# Altium schematic sheet FPGA_Memec_Virtex2_V2MB1000_Rev3_Dev_Kit.SchDoc: Example for Memec V2MB1000 Rev3 Board
size B; Address1: L3, 12a Rodborough Rd; Address2: Frenchs Forest; Address3: NSW; Address4: Australia 2086; DocumentNumber: 1; Organization: Altium Limited; SheetNumber: 1; SheetTotal: 3
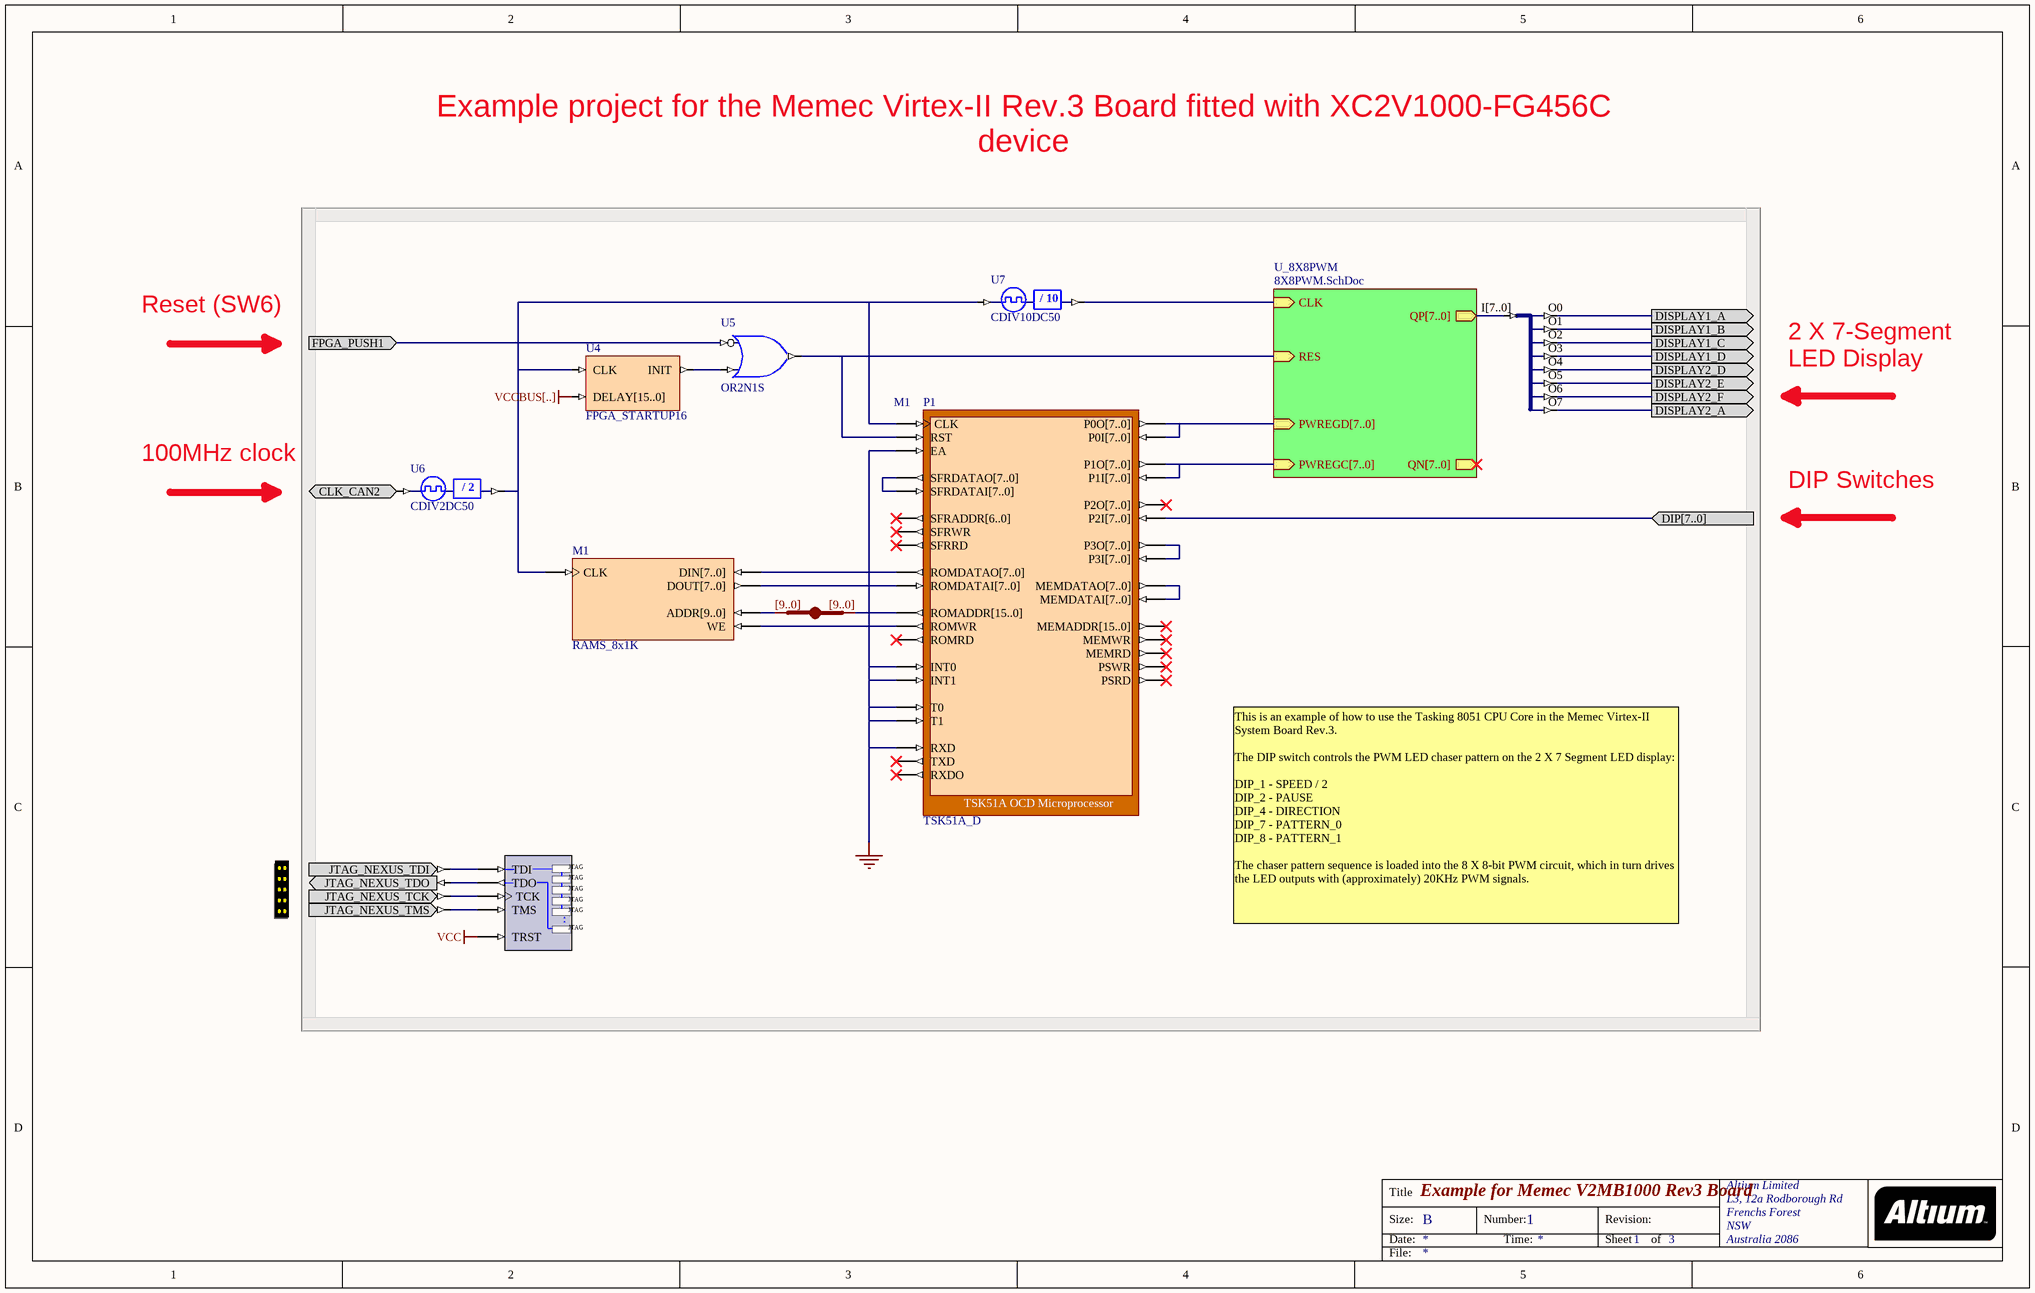
[diagram p0: FPGA_Memec_Virtex2_V2MB1000_Rev3_Dev_Kit.SchDoc]

## Parts
?  NEXUS_JTAG_CONNECTOR  (value not drawn)
JB_1  IndexA: [9..0]  (hidden comment: JB)
M1  RAMS_8x1K
NEXUS_JTAG_PORT  NEXUS_JTAG_PORT  (value not drawn)
P1  TSK51A_D  ChildCore1: M1
U4  FPGA_STARTUP16
U5  OR2N1S
U6  CDIV2DC50
U7  CDIV10DC50
U9  J8B_8S  (value not drawn)

## Sub-sheets
U_8X8PWM = 8X8PWM.SchDoc: PWREGD[7..0] (in), PWREGC[7..0] (in), CLK (in), RES (in), QP[7..0] (out), QN[7..0] (out)

## Ports
CLK_CAN2 (in), DIP[7..0] (in), DISPLAY1_A (out), DISPLAY1_B (out), DISPLAY1_C (out), DISPLAY1_D (out), DISPLAY2_A (out), DISPLAY2_D (out), DISPLAY2_E (out), DISPLAY2_F (out), FPGA_PUSH1 (in)

## Nets
GND: P1.EA P1.INT0 P1.INT1 P1.RXD P1.T0 P1.T1
VCC: NEXUS_JTAG_PORT.TRST
VCCBUS[..]: U4.DELAY[15..0]
CLK_CAN2: U6.CLKIN ; port CLK_CAN2
DIP[7..0]: P1.P2I[7..0] ; port DIP[7..0]
DISPLAY1_A: U9.O0 ; port DISPLAY1_A
DISPLAY1_B: U9.O1 ; port DISPLAY1_B
DISPLAY1_C: U9.O2 ; port DISPLAY1_C
DISPLAY1_D: U9.O3 ; port DISPLAY1_D
DISPLAY2_A: U9.O7 ; port DISPLAY2_A
DISPLAY2_D: U9.O4 ; port DISPLAY2_D
DISPLAY2_E: U9.O5 ; port DISPLAY2_E
DISPLAY2_F: U9.O6 ; port DISPLAY2_F
FPGA_PUSH1: U5.I0 ; port FPGA_PUSH1
Net?_JTAG_NEXUS_TCK: ?.JTAG_NEXUS_TCK NEXUS_JTAG_PORT.TCK
Net?_JTAG_NEXUS_TDI: ?.JTAG_NEXUS_TDI NEXUS_JTAG_PORT.TDI
Net?_JTAG_NEXUS_TDO: ?.JTAG_NEXUS_TDO NEXUS_JTAG_PORT.TDO
Net?_JTAG_NEXUS_TMS: ?.JTAG_NEXUS_TMS NEXUS_JTAG_PORT.TMS
NetJB_1_A[0..0]: JB_1.A[0..0] M1.ADDR[9..0]
NetJB_1_B[0..0]: JB_1.B[0..0] P1.ROMADDR[15..0]
NetM1_CLK: M1.CLK P1.CLK U4.CLK U6.CLKDV U7.CLKIN
NetM1_DIN[7..0]: M1.DIN[7..0] P1.ROMDATAO[7..0]
NetM1_DOUT[7..0]: M1.DOUT[7..0] P1.ROMDATAI[7..0]
NetM1_WE: M1.WE P1.ROMWR
NetP1_MEMDATAI[7..0]: P1.MEMDATAI[7..0] P1.MEMDATAO[7..0]
NetP1_P0I[7..0]: P1.P0I[7..0] P1.P0O[7..0] ; sheet U_8X8PWM/PWREGD[7..0]
NetP1_P1I[7..0]: P1.P1I[7..0] P1.P1O[7..0] ; sheet U_8X8PWM/PWREGC[7..0]
NetP1_P3I[7..0]: P1.P3I[7..0] P1.P3O[7..0]
NetP1_RST: P1.RST U5.O ; sheet U_8X8PWM/RES
NetP1_SFRDATAI[7..0]: P1.SFRDATAI[7..0] P1.SFRDATAO[7..0]
NetU4_INIT: U4.INIT U5.I1
NetU7_CLKDV: U7.CLKDV ; sheet U_8X8PWM/CLK
NetU9_I[7..0]: U9.I[7..0] ; sheet U_8X8PWM/QP[7..0]

Not connected (* = marked no-connect by the designer): P1 MEMADDR[15..0]* MEMRD* MEMWR* P2O[7..0]* PSRD* PSWR* ROMRD* RXDO* SFRADDR[6..0]* SFRRD* SFRWR* TXD*

## Notes on the sheet
- Example project for the Memec Virtex-II Rev.3 Board fitted with XC2V1000-FG456C device
- Reset (SW6)
- 2 X 7-Segment LED Display
- 100MHz clock
- DIP Switches
- This is an example of how to use the Tasking 8051 CPU Core in the Memec Virtex-II System Board Rev.3.
  The DIP switch controls the PWM LED chaser pattern on the 2 X 7 Segment LED display:
  DIP_1 - SPEED / 2
  DIP_2 - PAUSE
  DIP_4 - DIRECTION
  DIP_7 - PATTERN_0
  DIP_8 - PATTERN_1
  The chaser pattern sequence is loaded into the 8 X 8-bit PWM circuit, which in turn drives the LED outputs with (approximately) 20KHz PWM signals.
- Title
- Size:
- Date:
- B
- Number:
- Time:
- Revision:
- Sheet
- of
- File:
- (in symbol CDIV2DC50) / 2
- (in symbol CDIV10DC50) / 10
- (in symbol NEXUS_JTAG_PORT) JTAG; .

## Library data of the parts
? = NEXUS_JTAG_CONNECTOR: JTAG Port; PortComponent: True; Published: 19-Nov-2003; Publisher: Altium Limited
JB_1 = JB: System BUS Joiner; Published: 29-Jan-2004; Publisher: Altium Limited; IndexB: [9..0]; LastRevisionNo: 1.00.00; HelpURL: CR0118 FPGA Generic Library Guide.pdf#page=296; FunctionalClass: Bus Joiner
M1 = RAMS_8x1K: Single Port RAM; Memory_Depth: 1024; Memory_Type: RAM_SinglePortBlock; Memory_Width: 8; Memory_ClockEdge: Rising; Nexus_Core: Memory_Program; Memory_EnablePin: False; Published: 11/10/2004; Publisher: Altium Hobart Technology Center; Memory_ByteWrites: False
NEXUS_JTAG_PORT = NEXUS_JTAG_PORT: Soft Nexus-Chain Connector; NEXUS_JTAG_CONNECTOR: True; Published: 29-Jan-2004; Publisher: Altium Limited; Core Revision: 1.00.00
P1 = TSK51A_D: TSK51A OCD Microprocessor; NEXUS_CORE: Processor_OCDS; NEXUS_JTAG_DEVICE: True; NEXUS_JTAG_ORDER: 0; ChildModel1: RAM256x8_TSK51D; Published: 18/12/2003; Publisher: Altium Hobart Technology Centre; Core Revision: 1.00.00
U4 = FPGA_STARTUP16: FPGA Startup With 16 Bit Delay; Published: 21/01/2004; Publisher: Altium Hobart Technology Centre; Core Revision: 1.00.00
U5 = OR2N1S: 2-Input OR Gate with Active Low A Input, Single Pin Version; ArchiveName: GENERIC; VHDLIB_SIM: GENERIC_LIB; XilinxEquivalent: OR2B1; FunctionalClass: Logic Primitive; PortSize: 2; Published: 29-Jan-2004; Publisher: Altium Limited; LastRevisionNo: 1.00.00; HelpURL: CR0118 FPGA Generic Library Guide.pdf#page=404; SubClass: OR; PortStyle: Single Pin Version
U6 = CDIV2DC50: Clock Divider by 2 with 50% Duty Cycle Output; XilinxEquivalent: CLK_DIV2; DivisorRate: 2; DutyCycle: 50; ArchiveName: GENERIC; VHDLIB_SIM: GENERIC_LIB; Published: 29-Jan-2004; Publisher: Altium Limited; LastRevisionNo: 1.00.00; HelpURL: CR0118 FPGA Generic Library Guide.pdf#page=142; FunctionalClass: Clock Divider
U7 = CDIV10DC50: Clock Divider by 10 with 50% Duty Cycle Output; XilinxEquivalent: CLK_DIV10; DivisorRate: 10; DutyCycle: 50; ArchiveName: GENERIC; VHDLIB_SIM: GENERIC_LIB; Published: 29-Jan-2004; Publisher: Altium Limited; LastRevisionNo: 1.00.00; HelpURL: CR0118 FPGA Generic Library Guide.pdf#page=142; FunctionalClass: Clock Divider
U9 = J8B_8S: 8-Bit input bus to 8 single pin outputs; FunctionalClass: Bus Joiner; PortSize: 8; ArchiveName: GENERIC; VHDLIB_SIM: GENERIC_LIB; Published: 29-Jan-2004; Publisher: Altium Limited; LastRevisionNo: 1.00.00; HelpURL: CR0118 FPGA Generic Library Guide.pdf#page=303